# EasyEDA Pro project examples.epro, schematic Schematic4
Create Date: 2026-03-05; Page Name: P1; Project Name: EdaCopilotExamples; Schematic Name: Schematic4; Update Date: 2026-03-05; Company: EasyEDA.com; Page Size: A4; Version: V1.0
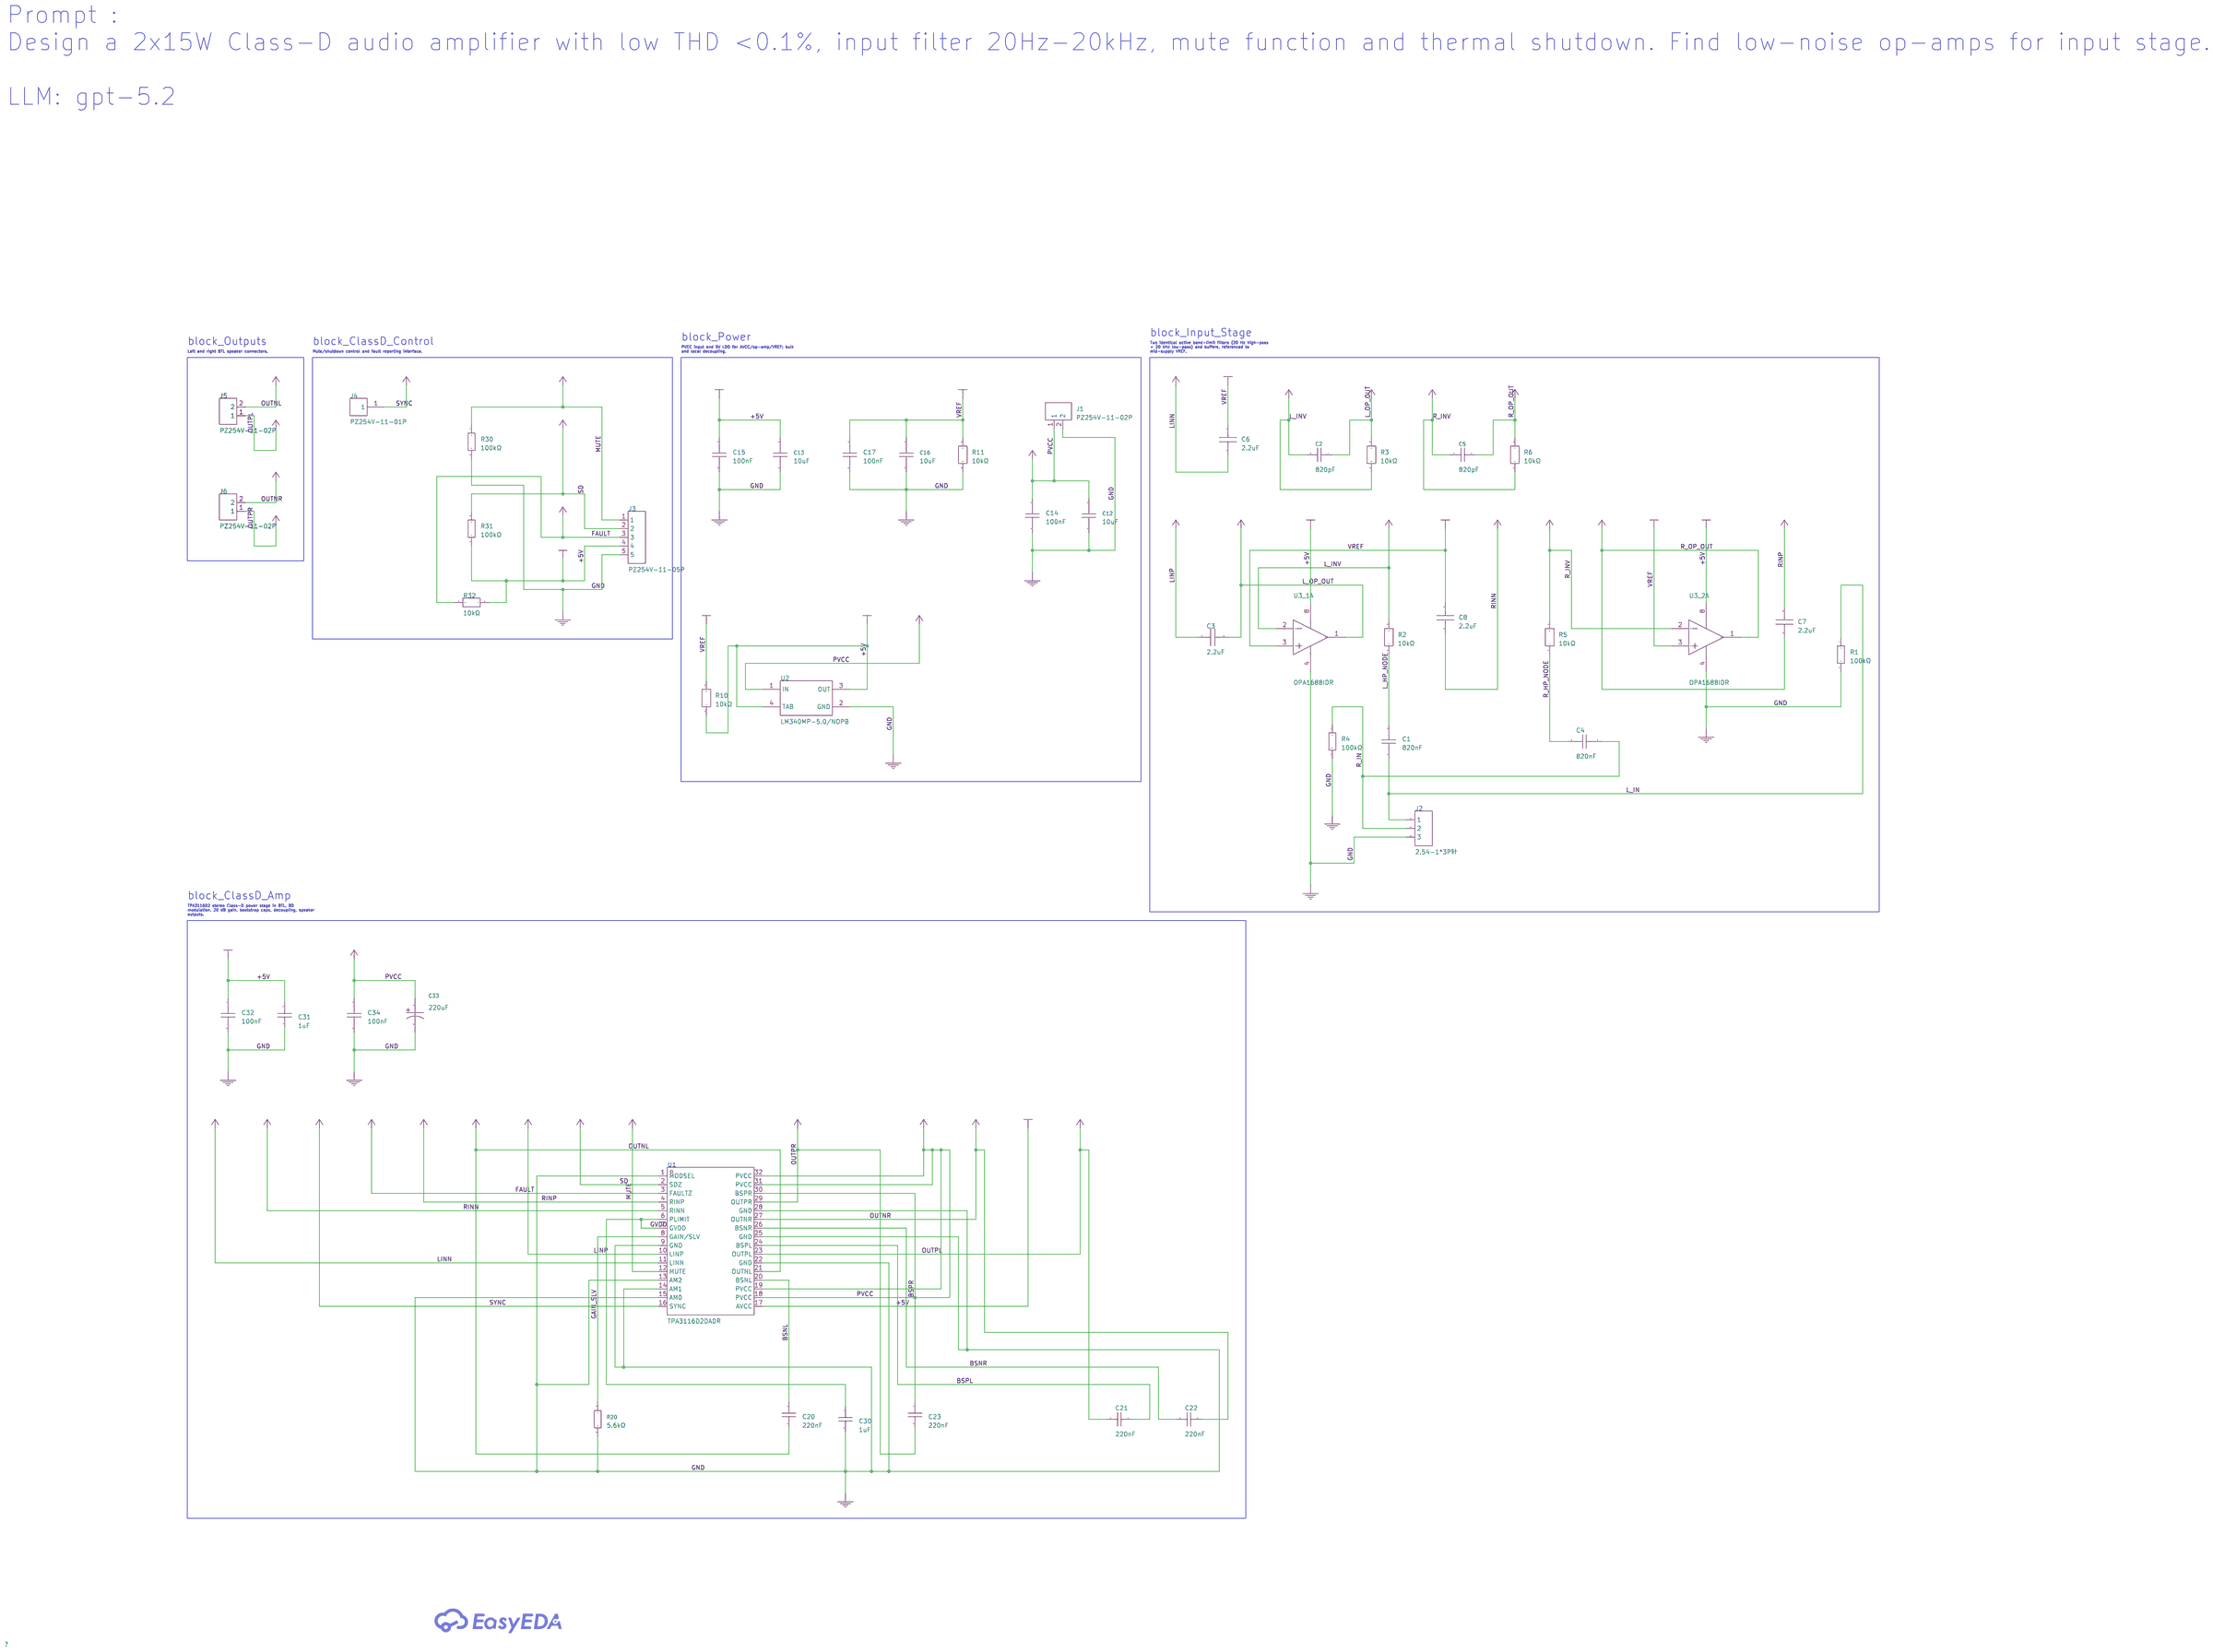
[diagram p3: schematic sheet]

## Parts
C1  820nF  [C0805]
C2  820pF  [C0603]
C3  2.2uF  [C0402]
C4  820nF  [C0805]
C5  820pF  [C0603]
C6  2.2uF  [C0402]
C7  2.2uF  [C0402]
C8  2.2uF  [C0402]
C12  10uF  [C0603]
C13  10uF  [C0603]
C14  100nF  [C0402]
C15  100nF  [C0402]
C16  10uF  [C0603]
C17  100nF  [C0402]
C20  220nF  [C0402]
C21  220nF  [C0402]
C22  220nF  [C0402]
C23  220nF  [C0402]
C30  1uF  [C0603]
C31  1uF  [C0603]
C32  100nF  [C0402]
C33  220uF  [CAP-SMD_BD10.0-L10.3-W10.3-LS11.3-FD]
C34  100nF  [C0402]
J1  PZ254V-11-02P  [HDR-TH_2P-P2.54-V-M]
J2  2.54-1*3P针  [HDR-TH_3P-P2.54-V-M-1]
J3  PZ254V-11-05P  [HDR-TH_5P-P2.54-V-M]
J4  PZ254V-11-01P  [HDR-TH_1P-P2.54-V-M]
J5  PZ254V-11-02P  [HDR-TH_2P-P2.54-V-M]
J6  PZ254V-11-02P  [HDR-TH_2P-P2.54-V-M]
R1  100kΩ  [R0402]
R2  10kΩ  [R0603]
R3  10kΩ  [R0603]
R4  100kΩ  [R0402]
R5  10kΩ  [R0603]
R6  10kΩ  [R0603]
R10  10kΩ  [R0603]
R11  10kΩ  [R0603]
R20  5.6kΩ  [R0603]
R30  100kΩ  [R0402]
R31  100kΩ  [R0402]
R32  10kΩ  [R0603]
U1  TPA3116D2DADR  [HTSSOP-32_L11.0-W6.1-P0.65-LS8.1-BL]
U2  LM340MP-5.0/NOPB  [SOT-223_L6.5-W3.5-P2.30-LS7.0-BR]
U3_1  OPA1688IDR  [SOP-8_L4.9-W3.9-P1.27-LS6.0-BL]  (section 1)
U3_2  OPA1688IDR  [SOP-8_L4.9-W3.9-P1.27-LS6.0-BL]  (section 1)

## Library data of the parts
C1 C4 = TCC0805X7R824K500DT: Capacitance:820nF Tolerance:±10% Tolerance:±10% Voltage Rating:50V Temperature Coefficient:X7R; LCSC Part Name: 820nF ±10% 50V; Supplier Part: C5375919; Manufacturer: CCTC(三环); Supplier Footprint: 0805; JLCPCB Part Class: Extended Part; Datasheet: https://item.szlcsc.com/datasheet/TCC0805X7R824K500DT/6236429.html; Supplier: LCSC; Tolerance: ±10%; Voltage Rating: 50V; Temperature Coefficient: X7R; supplier: LCSC; supplierId: C5375919
C2 C5 = CC0603JRNPO9BN821: Capacitance:820pF Tolerance:±5% Tolerance:±5% Voltage Rating:50V Temperature Coefficient:NP0; LCSC Part Name: 820pF ±5% 50V; Supplier Part: C107057; Manufacturer: YAGEO(国巨); Supplier Footprint: 0603; JLCPCB Part Class: Extended Part; Datasheet: https://item.szlcsc.com/datasheet/CC0603JRNPO9BN821/108273.html; Supplier: LCSC; Tolerance: ±5%; Voltage Rating: 50V; Temperature Coefficient: NP0; supplier: LCSC; supplierId: C107057
C3 C6-C8 = CL05A225MQ5NSNC: Capacitance:2.2uF Tolerance:±20% Tolerance:±20% Voltage Rating:6.3V Temperature Coefficient:X5R; LCSC Part Name: 2.2uF ±20% 6.3V; Supplier Part: C12530; Manufacturer: SAMSUNG(三星); Supplier Footprint: 0402; JLCPCB Part Class: Basic Part; Datasheet: https://item.szlcsc.com/datasheet/CL05A225MQ5NSNC/13164.html; Supplier: LCSC; Tolerance: ±20%; Voltage Rating: 6.3V; Temperature Coefficient: X5R; supplier: LCSC; supplierId: C12530
C12 C13 C16 = CL10A106MA8NRNC: Capacitance:10uF Tolerance:±20% Tolerance:±20% Voltage Rating:25V Temperature Coefficient:X5R; LCSC Part Name: 10uF ±20% 25V; Supplier Part: C96446; Manufacturer: SAMSUNG(三星); Supplier Footprint: 0603; JLCPCB Part Class: Basic Part; Datasheet: https://item.szlcsc.com/datasheet/CL10A106MA8NRNC/97651.html; Supplier: LCSC; Tolerance: ±20%; Voltage Rating: 25V; Temperature Coefficient: X5R; supplier: LCSC; supplierId: C96446
C14 C15 C17 C32 C34 = CL05B104KB54PNC: Capacitance:100nF Tolerance:±10% Tolerance:±10% Voltage Rating:50V Temperature Coefficient:X7R; LCSC Part Name: 100nF ±10% 50V; Supplier Part: C307331; Manufacturer: SAMSUNG(三星); Supplier Footprint: 0402; JLCPCB Part Class: Basic Part; Datasheet: https://item.szlcsc.com/datasheet/CL05B104KB54PNC/291005.html; Supplier: LCSC; Tolerance: ±10%; Voltage Rating: 50V; Temperature Coefficient: X7R; supplier: LCSC; supplierId: C307331
C20-C23 = CL05B224KO5NNNC: Capacitance:220nF Tolerance:±10% Tolerance:±10% Voltage Rating:16V Temperature Coefficient:X7R; LCSC Part Name: 220nF ±10% 16V; Supplier Part: C16772; Manufacturer: SAMSUNG(三星); Supplier Footprint: 0402; JLCPCB Part Class: Basic Part; Datasheet: https://item.szlcsc.com/datasheet/CL05B224KO5NNNC/17456.html; Supplier: LCSC; Tolerance: ±10%; Voltage Rating: 16V; Temperature Coefficient: X7R; supplier: LCSC; supplierId: C16772
C30 C31 = CL10B105KA8NNNC: Capacitance:1uF Tolerance:±10% Tolerance:±10% Voltage Rating:25V Temperature Coefficient:X7R; LCSC Part Name: 1uF ±10% 25V; Supplier Part: C29936; Manufacturer: SAMSUNG(三星); Supplier Footprint: 0603; JLCPCB Part Class: Extended Part; Datasheet: https://item.szlcsc.com/datasheet/CL10B105KA8NNNC/30690.html; Supplier: LCSC; Tolerance: ±10%; Voltage Rating: 25V; Temperature Coefficient: X7R; supplier: LCSC; supplierId: C29936
C33 = UWT1H221MNL1GS: Capacitance: Tolerance:±20% Tolerance:±20% Rated Voltage: Ripple Current:220mA@120Hz Equivalent Series Resistance(ESR):- φD: L: Lifetime @ Temp:1000hrs@105℃ Operating Temperature:-55℃~+105℃ Operating Temperature:-55℃~+105℃; LCSC Part Name: 220uF ±20% 50V; Supplier Part: C125977; Manufacturer: Nichicon(尼吉康); Supplier Footprint: SMD,D10xL10mm; JLCPCB Part Class: Extended Part; Datasheet: https://atta.szlcsc.com/upload/public/pdf/source/20180326/C125982_155E7F7F009D651CD598D898348721EF.pdf; Supplier: LCSC; Tolerance: ±20%; Ripple Current: 220mA@120Hz; Lifetime @ Temp: 1000hrs@105℃; Operating Temperature: -55℃~+105℃; supplier: LCSC; supplierId: C125977
J1 J5 J6 = PZ254V-11-02P: Pin Structure:1x2P Pitch:2.54mm Row Spacing:- Circluar Pins/Square Pins:Pin Header Mounting Type:Through Hole Number of Rows:1 Number of Pins:2P Current Rating:- Voltage Rating (Max):- Length of Mating Pin:6mm Insulation Height:2.5mm Length of End Connect; LCSC Part Name: 1x2P 间距:2.54mm 方针 直插; Supplier Part: C492401; Manufacturer: XFCN(兴飞); Supplier Footprint: 插件,P=2.54mm; JLCPCB Part Class: Extended Part; Datasheet: https://item.szlcsc.com/datasheet/PZ254V-11-02P/502957.html; Supplier: LCSC; Pin Structure: 1x2P; Pitch: 2.54mm; Circluar Pins/Square Pins: Pin Header; Mounting Type: Through Hole; Number of Rows: 1; Number of Pins: 2P; Length of Mating Pin: 6mm; Insulation Height: 2.5mm; Length of End Connection Pin: 3mm; Contact Material: Brass; Operating Temperature: -40℃~+105℃; Color: Black; supplier: LCSC; supplierId: C492401
J2 = 2.54-1*3P针: Pin Structure:1x3P Pitch:2.54mm Row Spacing:- Circluar Pins/Square Pins:Pin Header Mounting Type:Through Hole Number of Rows:1 Number of Pins:3P Current Rating:3A Voltage Rating (Max):- Length of Mating Pin:6mm Insulation Height:2.5mm Length of End Connec; LCSC Part Name: 1x3P 间距:2.54mm 方针 直插; Supplier Part: C49257; Manufacturer: BOOMELE(博穆精密); Supplier Footprint: 插件,P=2.54mm; JLCPCB Part Class: Extended Part; Datasheet: https://item.szlcsc.com/datasheet/2.54-1*3P%25E9%2592%2588/50265.html; Supplier: LCSC; Pin Structure: 1x3P; Pitch: 2.54mm; Circluar Pins/Square Pins: Pin Header; Mounting Type: Through Hole; Number of Rows: 1; Number of Pins: 3P; Current Rating: 3A; Length of Mating Pin: 6mm; Insulation Height: 2.5mm; Length of End Connection Pin: 3mm; Contact Material: Brass; Contact Plating: Gold; Operating Temperature: -40℃~+105℃; Color: Black; supplier: LCSC; supplierId: C49257
J3 = PZ254V-11-05P: Pin Structure:1x5P Pitch:2.54mm Row Spacing:- Circluar Pins/Square Pins:Pin Header Mounting Type:Through Hole Number of Rows:1 Number of Pins:5P Current Rating:- Voltage Rating (Max):- Length of Mating Pin:6mm Insulation Height:2.5mm Length of End Connect; LCSC Part Name: 1x5P 间距:2.54mm 方针 直插; Supplier Part: C492404; Manufacturer: XFCN(兴飞); Supplier Footprint: 插件,P=2.54mm; JLCPCB Part Class: Extended Part; Datasheet: https://item.szlcsc.com/datasheet/PZ254V-11-05P/502960.html; Supplier: LCSC; Pin Structure: 1x5P; Pitch: 2.54mm; Circluar Pins/Square Pins: Pin Header; Mounting Type: Through Hole; Number of Rows: 1; Number of Pins: 5P; Length of Mating Pin: 6mm; Insulation Height: 2.5mm; Length of End Connection Pin: 3mm; Contact Material: Brass; Operating Temperature: -40℃~+105℃; Color: Black; supplier: LCSC; supplierId: C492404
J4 = PZ254V-11-01P: Pin Structure:1x1P Pitch:2.54mm Row Spacing:- Circluar Pins/Square Pins:Pin Header Mounting Type:Through Hole Number of Rows:1 Number of Pins:1P Current Rating:- Voltage Rating (Max):- Length of Mating Pin:6mm Insulation Height:2.5mm Length of End Connect; LCSC Part Name: 1x1P 间距:2.54mm 方针 直插; Supplier Part: C492400; Manufacturer: XFCN(兴飞); Supplier Footprint: 插件,P=2.54mm; JLCPCB Part Class: Extended Part; Datasheet: https://item.szlcsc.com/datasheet/PZ254V-11-01P/502956.html; Supplier: LCSC; Pin Structure: 1x1P; Pitch: 2.54mm; Circluar Pins/Square Pins: Pin Header; Mounting Type: Through Hole; Number of Rows: 1; Number of Pins: 1P; Length of Mating Pin: 6mm; Insulation Height: 2.5mm; Length of End Connection Pin: 3mm; Contact Material: Brass; Operating Temperature: -40℃~+105℃; Color: Black; supplier: LCSC; supplierId: C492400
R1 R4 R30 R31 = RC0402FR-07100KL: Type:Thick Film Resistor Resistance:100kΩ Tolerance:±1% Tolerance:±1% Power(Watts):62.5mW Voltage-Supply(Max):50V Temperature Coefficient:±100ppm/℃ Temperature Coefficient:±100ppm/℃ Operating Temperature:-55℃~+155℃ Operating Temperature:-55℃~+155℃; LCSC Part Name: 厚膜电阻 100kΩ ±1% 62.5mW; Supplier Part: C60491; Manufacturer: YAGEO(国巨); Supplier Footprint: 0402; JLCPCB Part Class: Extended Part; Datasheet: https://item.szlcsc.com/datasheet/RC0402FR-07100KL/61543.html; Supplier: LCSC; Type: Thick Film Resistor; Tolerance: ±1%; Power(Watts): 62.5mW; Voltage-Supply(Max): 50V; Temperature Coefficient: ±100ppm/℃; Operating Temperature: -55℃~+155℃; supplier: LCSC; supplierId: C60491
R2 R3 R5 R6 R10 R11 R32 = FRC0603J103 TS: Type:Thick Film Resistor Resistance:10kΩ Tolerance:±5% Tolerance:±5% Power(Watts):100mW Voltage-Supply(Max):75V Temperature Coefficient:±100ppm/℃ Temperature Coefficient:±100ppm/℃ Operating Temperature:-55℃~+155℃ Operating Temperature:-55℃~+155℃; LCSC Part Name: 10kΩ ±5% 100mW 厚膜电阻; Supplier Part: C2930027; Manufacturer: FOJAN(富捷); Supplier Footprint: 0603; JLCPCB Part Class: Extended Part; Datasheet: https://item.szlcsc.com/datasheet/FRC0603J103%2520TS/3266960.html; Supplier: LCSC; Type: Thick Film Resistor; Tolerance: ±5%; Power(Watts): 100mW; Voltage-Supply(Max): 75V; Temperature Coefficient: ±100ppm/℃; Operating Temperature: -55℃~+155℃; supplier: LCSC; supplierId: C2930027
R20 = 0603WAF5601T5E: Type:Thick Film Resistor Resistance:5.6kΩ Tolerance:±1% Tolerance:±1% Power(Watts):100mW Voltage-Supply(Max):75V Temperature Coefficient:±100ppm/℃ Temperature Coefficient:±100ppm/℃ Operating Temperature:-55℃~+155℃ Operating Temperature:-55℃~+155℃; LCSC Part Name: 5.6kΩ ±1% 100mW 厚膜电阻; Supplier Part: C23189; Manufacturer: UNI-ROYAL(厚声); Supplier Footprint: 0603; JLCPCB Part Class: Basic Part; Datasheet: https://item.szlcsc.com/datasheet/0603WAF5601T5E/23916.html; Supplier: LCSC; Type: Thick Film Resistor; Tolerance: ±1%; Power(Watts): 100mW; Voltage-Supply(Max): 75V; Temperature Coefficient: ±100ppm/℃; Operating Temperature: -55℃~+155℃; supplier: LCSC; supplierId: C23189
U1 = TPA3116D2DADR_C50144: Class:Class D Amplifier Speaker Channels:Dual Channel Output Power:50Wx2@4Ω Voltage - Supply:4.5V~26V Voltage - Supply:4.5V~26V; LCSC Part Name: 15W, 30W, 50W 无滤波器 Class-D 立体声功率放大器; Supplier Part: C50144; Manufacturer: TI(德州仪器); Supplier Footprint: HTSSOP-32-6.1mm; JLCPCB Part Class: Extended Part; Datasheet: https://www.ti.com/cn/lit/gpn/tpa3116d2; Supplier: LCSC; Class: Class D Amplifier; Speaker Channels: Dual Channel; Output Power: 50Wx2@4Ω; Voltage - Supply: 4.5V~26V; supplier: LCSC; supplierId: C50144
U2 = LM340MP-5.0/NOPB: Output Type:Fixed Voltage - Supply:35V Output Voltage:5V Output Voltage:5V Output Current:1A Power Supply Rejection Ratio (PSRR):70dB@(120Hz) Voltage Dropout:2V@(1A) standby current:8mA Noise:40uV Features:Short Circuit Protection；Over Temperature Protect; LCSC Part Name: 1.5A、35V 线性稳压器; Supplier Part: C131990; Manufacturer: TI(德州仪器); Supplier Footprint: SOT-223; JLCPCB Part Class: Extended Part; Datasheet: https://www.ti.com/cn/lit/gpn/lm340; Supplier: LCSC; Output Type: Fixed; Voltage - Supply: 35V; Output Voltage: 5V; Output Current: 1A; Power Supply Rejection Ratio (PSRR): 70dB@(120Hz); Voltage Dropout: 2V@(1A); standby current: 8mA; Noise: 40uV; Features: Short Circuit Protection；Over Temperature Protection；Over Current Protection; Operating Temperature: 0℃~+125℃; Output Configuration: Positive; Number of Outputs: 1; supplier: LCSC; supplierId: C131990
U3_1 U3_2 = OPA1688IDR: Number of Channels:2 Maximum Power Supply Range (Vdd-Vss):36V Rail to Rail:Rail-to-Rail Output Gain Bandwidth Product:10MHz Vos - Input Offset Voltage:250uV Input Offset Voltage Drift(Vos TC):0.5uV/℃ Slew Rate:8V/us Ib - Input Bias Current:10pA Input Offs; Supplier Part: C206212; Manufacturer: TI(德州仪器); Supplier Footprint: SOP-8; JLCPCB Part Class: Extended Part; Datasheet: https://www.ti.com/cn/lit/gpn/opa1688; Supplier: LCSC; Number of Channels: 2; Maximum Power Supply Range (Vdd-Vss): 36V; Rail to Rail: Rail-to-Rail Output; Gain Bandwidth Product: 10MHz; Vos - Input Offset Voltage: 250uV; Input Offset Voltage Drift(Vos TC): 0.5uV/℃; Slew Rate: 8V/us; Ib - Input Bias Current: 10pA; Input Offset Current(Ios): 7pA; Noise density(eN): 8nV/√Hz@1kHz; Common Mode Rejection Ratio(CMRR): 120dB; Quiescent Current: 1.6mA; Output Current: 75mA; Operating Temperature: -40℃~+85℃; Single supply: 4.5V~36V; Dual Supply: 2.25V~18V；-18V~-2.25V; supplier: LCSC; supplierId: C206212

## Nets
+5V: C13.1 C15.1 C31.1 C32.1 J3.4 R10.1 R31.1 R32.1 U1.17(AVCC) U2.3(OUT) U2.4(TAB) U3_1.8(VCC) U3_2.8(VCC)
GND: C12.2 C13.2 C14.2 C15.2 C16.2 C17.2 C30.2 C31.2 C32.2 C33.2 C34.2 J1.2 J2.3 J3.5 R1.2 R4.2 R11.2 R20.2 R30.2 U1.1(MODSEL) U1.9(GND) U1.13(AM2) U1.14(AM1) U1.15(AM0) U1.22(GND) U1.25(GND) U1.28(GND) U2.2(GND) U3_1.4(GND) U3_2.4(GND)
PVCC: C12.1 C14.1 C33.1 C34.1 J1.1 U1.18(PVCC) U1.19(PVCC) U1.31(PVCC) U1.32(PVCC) U2.1(IN)
BSNL: C20.1 U1.20(BSNL)
BSNR: C22.1 U1.26(BSNR)
BSPL: C21.1 U1.24(BSPL)
BSPR: C23.1 U1.30(BSPR)
FAULT: J3.3 R32.2 U1.3(FAULTZ)
GAIN_SLV: R20.1 U1.8(GAIN/SLV)
GVDD: C30.1 U1.6(PLIMIT) U1.7(GVDD)
L_HP_NODE: C1.2 R2.1
L_IN: C1.1 J2.1 R1.1
L_INV: C2.2 R2.2 R3.2 U3_1.2(IN1-)
L_OP_OUT: C2.1 C3.1 R3.1 U3_1.1(OUT1)
LINN: C6.2 U1.11(LINN)
LINP: C3.2 U1.10(LINP)
MUTE: J3.1 R30.1 U1.12(MUTE)
OUTNL: C20.2 J5.2 U1.21(OUTNL)
OUTNR: C22.2 J6.2 U1.27(OUTNR)
OUTPL: C21.2 J5.1 U1.23(OUTPL)
OUTPR: C23.2 J6.1 U1.29(OUTPR)
R_HP_NODE: C4.2 R5.1
R_IN: C4.1 J2.2 R4.1
R_INV: C5.2 R5.2 R6.2 U3_2.2(IN1-)
R_OP_OUT: C5.1 C7.1 R6.1 U3_2.1(OUT1)
RINN: C8.2 U1.5(RINN)
RINP: C7.2 U1.4(RINP)
SD: J3.2 R31.2 U1.2(SDZ)
SYNC: J4.1 U1.16(SYNC)
VREF: C6.1 C8.1 C16.1 C17.1 R10.2 R11.1 U3_1.3(IN+) U3_2.3(IN+)

## Notes on the sheet
- Prompt :
  Design a 2x15W Class-D audio amplifier with low THD <0.1%, input filter 20Hz-20kHz, mute function and thermal shutdown. Find low-noise op-amps for input stage.
  LLM: gpt-5.2
- block_Power
- block_Input_Stage
- block_Outputs
- block_ClassD_Control
- PVCC input and 5V LDO for AVCC/op-amp/VREF; bulk
  and local decoupling.
- Two identical active band-limit filters (20 Hz high-pass
  + 20 kHz low-pass) and buffers, referenced to
  mid-supply VREF.
- Left and right BTL speaker connectors.
- Mute/shutdown control and fault reporting interface.
- block_ClassD_Amp
- TPA3116D2 stereo Class-D power stage in BTL, BD
  modulation, 20 dB gain, bootstrap caps, decoupling, speaker
  outputs.
